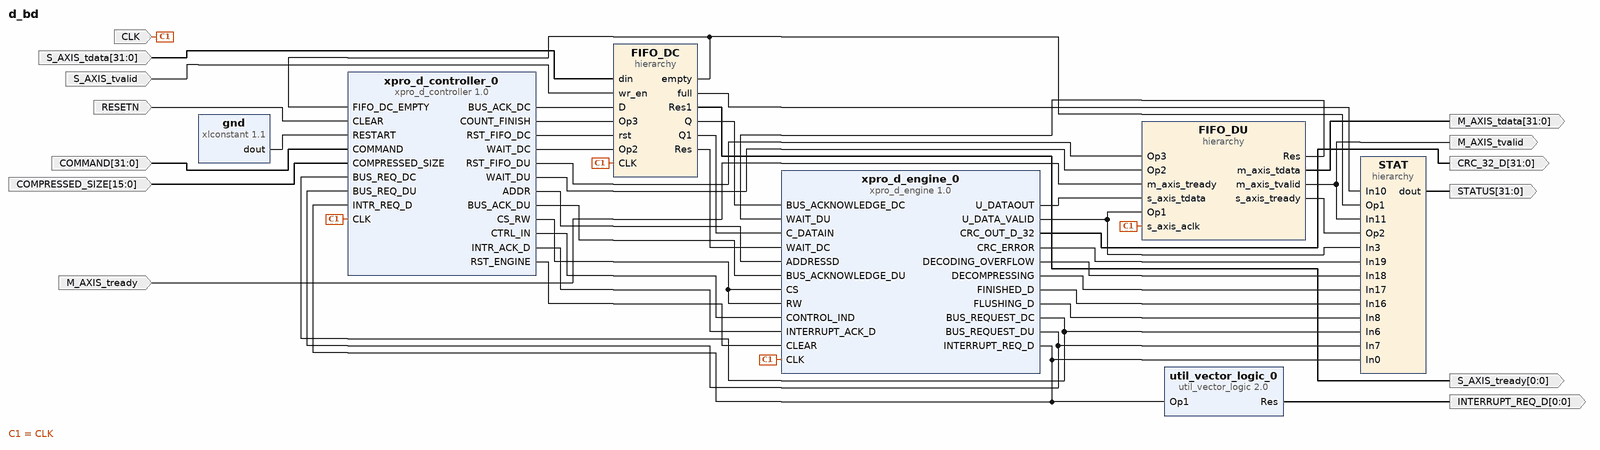
[diagram p0: block diagram of the top level]
# Vivado block design d_bd, Vivado 2014.4
create_bd_design d_bd

create_bd_port -dir I -type clk CLK
create_bd_port -dir I -from 31 -to 0 COMMAND
create_bd_port -dir I -from 15 -to 0 COMPRESSED_SIZE
create_bd_port -dir O -from 31 -to 0 CRC_32_D
create_bd_port -dir O -from 0 -to 0 INTERRUPT_REQ_D
create_bd_port -dir O -from 31 -to 0 M_AXIS_tdata
create_bd_port -dir I M_AXIS_tready
create_bd_port -dir O M_AXIS_tvalid
create_bd_port -dir I RESETN
create_bd_port -dir O -from 31 -to 0 STATUS
create_bd_port -dir I -from 31 -to 0 S_AXIS_tdata
create_bd_port -dir O -from 0 -to 0 S_AXIS_tready
create_bd_port -dir I S_AXIS_tvalid

create_bd_cell -type hier FIFO_DC
create_bd_cell -type hier FIFO_DU
create_bd_cell -type hier STAT
create_bd_cell -type ip -vlnv xilinx.com:ip:xlconstant:1.1 gnd
set_property -dict {CONFIG.CONST_VAL 0} [get_bd_cells gnd]
create_bd_cell -type ip -vlnv xilinx.com:ip:util_vector_logic:2.0 util_vector_logic_0
set_property -dict {CONFIG.C_SIZE 1 CONFIG.C_OPERATION not} [get_bd_cells util_vector_logic_0]
create_bd_cell -type ip -vlnv mohdazainol:user_ip:xpro_d_controller:1.0 xpro_d_controller_0
create_bd_cell -type ip -vlnv mohdazainol:user_ip:xpro_d_engine:1.0 xpro_d_engine_0

# ---- hierarchy /FIFO_DC ----
current_bd_instance /FIFO_DC
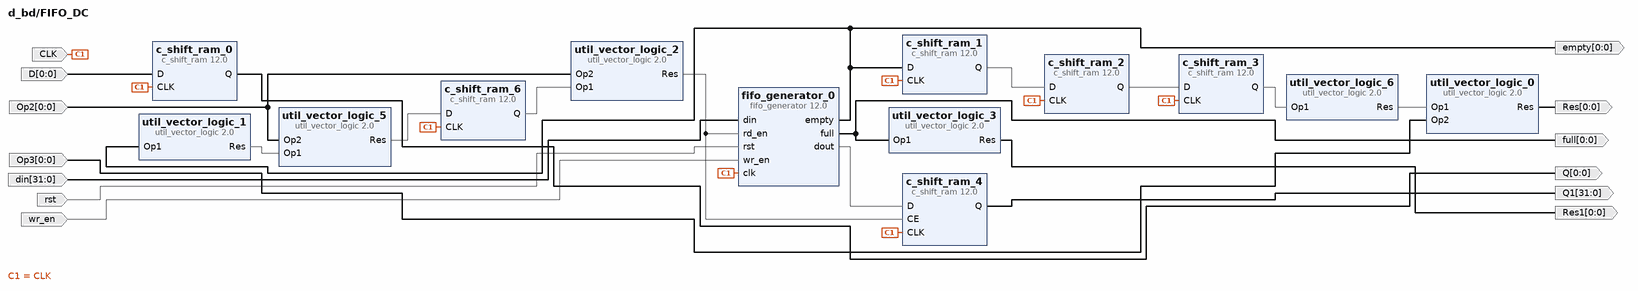
[diagram p1: block diagram inside /FIFO_DC]
create_bd_pin -dir I -type clk CLK
create_bd_pin -dir I -from 0 -to 0 -type data D
create_bd_pin -dir I -from 0 -to 0 Op2
create_bd_pin -dir I -from 0 -to 0 Op3
create_bd_pin -dir O -from 0 -to 0 -type data Q
create_bd_pin -dir O -from 31 -to 0 -type data Q1
create_bd_pin -dir O -from 0 -to 0 Res
create_bd_pin -dir O -from 0 -to 0 Res1
create_bd_pin -dir I -from 31 -to 0 din
create_bd_pin -dir O -from 0 -to 0 empty
create_bd_pin -dir O -from 0 -to 0 full
create_bd_pin -dir I rst
create_bd_pin -dir I wr_en

create_bd_cell -type ip -vlnv xilinx.com:ip:c_shift_ram:12.0 c_shift_ram_0
set_property -dict {CONFIG.Width 1 CONFIG.Depth 1 CONFIG.DefaultData 0 CONFIG.AsyncInitVal 0} [get_bd_cells c_shift_ram_0]
create_bd_cell -type ip -vlnv xilinx.com:ip:c_shift_ram:12.0 c_shift_ram_1
set_property -dict {CONFIG.Width 1 CONFIG.Depth 1 CONFIG.DefaultData 0 CONFIG.AsyncInitVal 0} [get_bd_cells c_shift_ram_1]
create_bd_cell -type ip -vlnv xilinx.com:ip:c_shift_ram:12.0 c_shift_ram_2
set_property -dict {CONFIG.Width 1 CONFIG.Depth 1 CONFIG.DefaultData 0 CONFIG.AsyncInitVal 0} [get_bd_cells c_shift_ram_2]
create_bd_cell -type ip -vlnv xilinx.com:ip:c_shift_ram:12.0 c_shift_ram_3
set_property -dict {CONFIG.Width 1 CONFIG.Depth 1 CONFIG.DefaultData 0 CONFIG.AsyncInitVal 0} [get_bd_cells c_shift_ram_3]
create_bd_cell -type ip -vlnv xilinx.com:ip:c_shift_ram:12.0 c_shift_ram_4
set_property -dict [list \
  CONFIG.CE true \
  CONFIG.Width 32 \
  CONFIG.Depth 1 \
  CONFIG.DefaultData 00000000000000000000000000000000 \
  CONFIG.AsyncInitVal 00000000000000000000000000000000 \
] [get_bd_cells c_shift_ram_4]
create_bd_cell -type ip -vlnv xilinx.com:ip:c_shift_ram:12.0 c_shift_ram_6
set_property -dict {CONFIG.Width 1 CONFIG.Depth 1 CONFIG.DefaultData 0 CONFIG.AsyncInitVal 0} [get_bd_cells c_shift_ram_6]
create_bd_cell -type ip -vlnv xilinx.com:ip:fifo_generator:12.0 fifo_generator_0
set_property -dict {CONFIG.Input_Data_Width 32} [get_bd_cells fifo_generator_0]
create_bd_cell -type ip -vlnv xilinx.com:ip:util_vector_logic:2.0 util_vector_logic_0
set_property -dict {CONFIG.C_SIZE 1 CONFIG.C_OPERATION or} [get_bd_cells util_vector_logic_0]
create_bd_cell -type ip -vlnv xilinx.com:ip:util_vector_logic:2.0 util_vector_logic_1
set_property -dict {CONFIG.C_SIZE 1 CONFIG.C_OPERATION not} [get_bd_cells util_vector_logic_1]
create_bd_cell -type ip -vlnv xilinx.com:ip:util_vector_logic:2.0 util_vector_logic_2
set_property -dict {CONFIG.C_SIZE 1} [get_bd_cells util_vector_logic_2]
create_bd_cell -type ip -vlnv xilinx.com:ip:util_vector_logic:2.0 util_vector_logic_3
set_property -dict {CONFIG.C_SIZE 1 CONFIG.C_OPERATION not} [get_bd_cells util_vector_logic_3]
create_bd_cell -type ip -vlnv xilinx.com:ip:util_vector_logic:2.0 util_vector_logic_5
set_property -dict {CONFIG.C_SIZE 1} [get_bd_cells util_vector_logic_5]
create_bd_cell -type ip -vlnv xilinx.com:ip:util_vector_logic:2.0 util_vector_logic_6
set_property -dict {CONFIG.C_SIZE 1 CONFIG.C_OPERATION not} [get_bd_cells util_vector_logic_6]

# ---- hierarchy /FIFO_DU ----
current_bd_instance /FIFO_DU
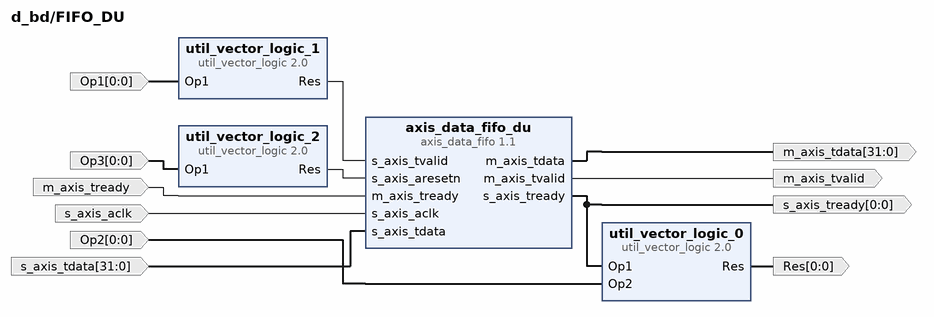
[diagram p2: block diagram inside /FIFO_DU]
create_bd_pin -dir I -from 0 -to 0 Op1
create_bd_pin -dir I -from 0 -to 0 Op2
create_bd_pin -dir I -from 0 -to 0 Op3
create_bd_pin -dir O -from 0 -to 0 Res
create_bd_pin -dir O -from 31 -to 0 m_axis_tdata
create_bd_pin -dir I m_axis_tready
create_bd_pin -dir O m_axis_tvalid
create_bd_pin -dir I -type clk s_axis_aclk
create_bd_pin -dir I -from 31 -to 0 s_axis_tdata
create_bd_pin -dir O -from 0 -to 0 s_axis_tready

create_bd_cell -type ip -vlnv xilinx.com:ip:axis_data_fifo:1.1 axis_data_fifo_du
set_property -dict {CONFIG.TDATA_NUM_BYTES 4} [get_bd_cells axis_data_fifo_du]
create_bd_cell -type ip -vlnv xilinx.com:ip:util_vector_logic:2.0 util_vector_logic_0
set_property -dict {CONFIG.C_SIZE 1} [get_bd_cells util_vector_logic_0]
create_bd_cell -type ip -vlnv xilinx.com:ip:util_vector_logic:2.0 util_vector_logic_1
set_property -dict {CONFIG.C_SIZE 1 CONFIG.C_OPERATION not} [get_bd_cells util_vector_logic_1]
create_bd_cell -type ip -vlnv xilinx.com:ip:util_vector_logic:2.0 util_vector_logic_2
set_property -dict {CONFIG.C_SIZE 1 CONFIG.C_OPERATION not} [get_bd_cells util_vector_logic_2]

# ---- hierarchy /STAT ----
current_bd_instance /STAT
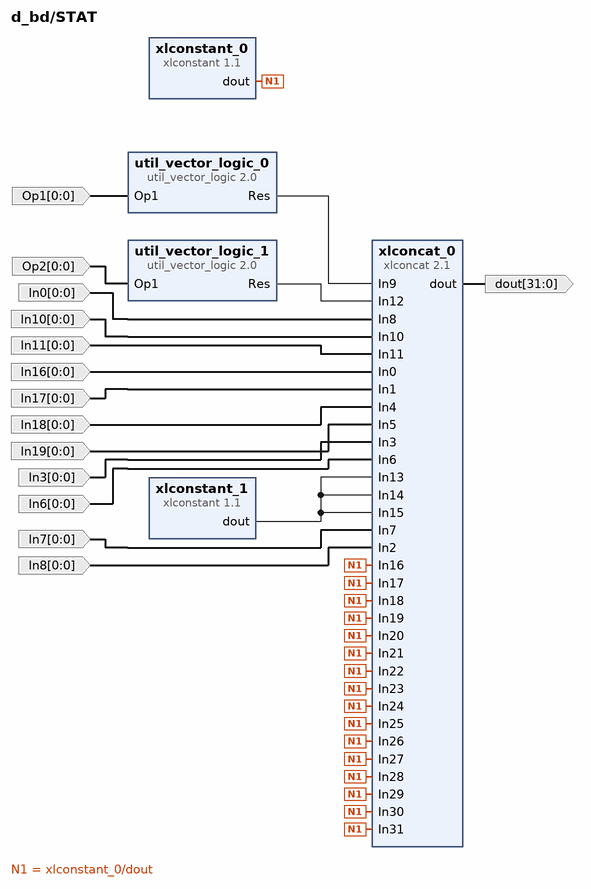
[diagram p3: block diagram inside /STAT]
create_bd_pin -dir I -from 0 -to 0 In0
create_bd_pin -dir I -from 0 -to 0 In3
create_bd_pin -dir I -from 0 -to 0 In6
create_bd_pin -dir I -from 0 -to 0 In7
create_bd_pin -dir I -from 0 -to 0 In8
create_bd_pin -dir I -from 0 -to 0 In10
create_bd_pin -dir I -from 0 -to 0 In11
create_bd_pin -dir I -from 0 -to 0 In16
create_bd_pin -dir I -from 0 -to 0 In17
create_bd_pin -dir I -from 0 -to 0 In18
create_bd_pin -dir I -from 0 -to 0 In19
create_bd_pin -dir I -from 0 -to 0 Op1
create_bd_pin -dir I -from 0 -to 0 Op2
create_bd_pin -dir O -from 31 -to 0 dout

create_bd_cell -type ip -vlnv xilinx.com:ip:util_vector_logic:2.0 util_vector_logic_0
set_property -dict {CONFIG.C_SIZE 1 CONFIG.C_OPERATION not} [get_bd_cells util_vector_logic_0]
create_bd_cell -type ip -vlnv xilinx.com:ip:util_vector_logic:2.0 util_vector_logic_1
set_property -dict {CONFIG.C_SIZE 1 CONFIG.C_OPERATION not} [get_bd_cells util_vector_logic_1]
create_bd_cell -type ip -vlnv xilinx.com:ip:xlconcat:2.1 xlconcat_0
set_property -dict {CONFIG.NUM_PORTS 32} [get_bd_cells xlconcat_0]
create_bd_cell -type ip -vlnv xilinx.com:ip:xlconstant:1.1 xlconstant_0
set_property -dict {CONFIG.CONST_VAL 0} [get_bd_cells xlconstant_0]
create_bd_cell -type ip -vlnv xilinx.com:ip:xlconstant:1.1 xlconstant_1
set_property -dict {CONFIG.CONST_VAL 0} [get_bd_cells xlconstant_1]

# ---- connections ----

current_bd_instance /FIFO_DC
connect_bd_net [get_bd_pins CLK] \
  [get_bd_pins c_shift_ram_0/CLK] [get_bd_pins c_shift_ram_1/CLK] [get_bd_pins c_shift_ram_2/CLK] \
  [get_bd_pins c_shift_ram_3/CLK] [get_bd_pins c_shift_ram_4/CLK] [get_bd_pins c_shift_ram_6/CLK] \
  [get_bd_pins fifo_generator_0/clk]
connect_bd_net [get_bd_pins D] [get_bd_pins c_shift_ram_0/D]
connect_bd_net -net Op2_1 [get_bd_pins Op2] [get_bd_pins util_vector_logic_2/Op2] [get_bd_pins util_vector_logic_5/Op2]
connect_bd_net -net Op3_1 [get_bd_pins Op3] [get_bd_pins util_vector_logic_0/Op2]
connect_bd_net [get_bd_pins c_shift_ram_0/Q] [get_bd_pins Q]
connect_bd_net [get_bd_pins c_shift_ram_1/Q] [get_bd_pins c_shift_ram_2/D]
connect_bd_net [get_bd_pins c_shift_ram_2/Q] [get_bd_pins c_shift_ram_3/D]
connect_bd_net [get_bd_pins c_shift_ram_3/Q] [get_bd_pins util_vector_logic_6/Op1]
connect_bd_net [get_bd_pins c_shift_ram_4/Q] [get_bd_pins Q1]
connect_bd_net [get_bd_pins c_shift_ram_6/Q] [get_bd_pins util_vector_logic_2/Op1]
connect_bd_net [get_bd_pins din] [get_bd_pins fifo_generator_0/din]
connect_bd_net [get_bd_pins fifo_generator_0/dout] [get_bd_pins c_shift_ram_4/D]
connect_bd_net [get_bd_pins fifo_generator_0/empty] [get_bd_pins empty] [get_bd_pins c_shift_ram_1/D] [get_bd_pins util_vector_logic_1/Op1]
connect_bd_net [get_bd_pins fifo_generator_0/full] [get_bd_pins full] [get_bd_pins util_vector_logic_3/Op1]
connect_bd_net [get_bd_pins rst] [get_bd_pins fifo_generator_0/rst]
connect_bd_net [get_bd_pins util_vector_logic_0/Res] [get_bd_pins Res]
connect_bd_net [get_bd_pins util_vector_logic_1/Res] [get_bd_pins util_vector_logic_5/Op1]
connect_bd_net [get_bd_pins util_vector_logic_2/Res] [get_bd_pins c_shift_ram_4/CE] [get_bd_pins fifo_generator_0/rd_en]
connect_bd_net [get_bd_pins util_vector_logic_3/Res] [get_bd_pins Res1]
connect_bd_net [get_bd_pins util_vector_logic_5/Res] [get_bd_pins c_shift_ram_6/D]
connect_bd_net [get_bd_pins util_vector_logic_6/Res] [get_bd_pins util_vector_logic_0/Op1]
connect_bd_net [get_bd_pins wr_en] [get_bd_pins fifo_generator_0/wr_en]

current_bd_instance /FIFO_DU
connect_bd_net -net Op1_1 [get_bd_pins Op1] [get_bd_pins util_vector_logic_1/Op1]
connect_bd_net -net Op2_1 [get_bd_pins Op2] [get_bd_pins util_vector_logic_0/Op2]
connect_bd_net -net Op3_1 [get_bd_pins Op3] [get_bd_pins util_vector_logic_2/Op1]
connect_bd_net -net axis_data_fifo_0_m_axis_tdata [get_bd_pins axis_data_fifo_du/m_axis_tdata] [get_bd_pins m_axis_tdata]
connect_bd_net -net axis_data_fifo_0_m_axis_tvalid [get_bd_pins axis_data_fifo_du/m_axis_tvalid] [get_bd_pins m_axis_tvalid]
connect_bd_net -net axis_data_fifo_0_s_axis_tready [get_bd_pins axis_data_fifo_du/s_axis_tready] \
  [get_bd_pins s_axis_tready] [get_bd_pins util_vector_logic_0/Op1]
connect_bd_net [get_bd_pins m_axis_tready] [get_bd_pins axis_data_fifo_du/m_axis_tready]
connect_bd_net [get_bd_pins s_axis_aclk] [get_bd_pins axis_data_fifo_du/s_axis_aclk]
connect_bd_net [get_bd_pins s_axis_tdata] [get_bd_pins axis_data_fifo_du/s_axis_tdata]
connect_bd_net [get_bd_pins util_vector_logic_0/Res] [get_bd_pins Res]
connect_bd_net [get_bd_pins util_vector_logic_1/Res] [get_bd_pins axis_data_fifo_du/s_axis_tvalid]
connect_bd_net [get_bd_pins util_vector_logic_2/Res] [get_bd_pins axis_data_fifo_du/s_axis_aresetn]

current_bd_instance /STAT
connect_bd_net -net In0_1 [get_bd_pins In0] [get_bd_pins xlconcat_0/In8]
connect_bd_net -net In10_1 [get_bd_pins In10] [get_bd_pins xlconcat_0/In10]
connect_bd_net -net In11_1 [get_bd_pins In11] [get_bd_pins xlconcat_0/In11]
connect_bd_net -net In16_1 [get_bd_pins In16] [get_bd_pins xlconcat_0/In0]
connect_bd_net -net In17_1 [get_bd_pins In17] [get_bd_pins xlconcat_0/In1]
connect_bd_net -net In18_1 [get_bd_pins In18] [get_bd_pins xlconcat_0/In4]
connect_bd_net -net In19_1 [get_bd_pins In19] [get_bd_pins xlconcat_0/In5]
connect_bd_net -net In3_1 [get_bd_pins In3] [get_bd_pins xlconcat_0/In3]
connect_bd_net -net In6_1 [get_bd_pins In6] [get_bd_pins xlconcat_0/In6]
connect_bd_net -net In7_1 [get_bd_pins In7] [get_bd_pins xlconcat_0/In7]
connect_bd_net -net In8_1 [get_bd_pins In8] [get_bd_pins xlconcat_0/In2]
connect_bd_net -net Op1_1 [get_bd_pins Op1] [get_bd_pins util_vector_logic_0/Op1]
connect_bd_net -net Op2_1 [get_bd_pins Op2] [get_bd_pins util_vector_logic_1/Op1]
connect_bd_net [get_bd_pins util_vector_logic_0/Res] [get_bd_pins xlconcat_0/In9]
connect_bd_net [get_bd_pins util_vector_logic_1/Res] [get_bd_pins xlconcat_0/In12]
connect_bd_net [get_bd_pins xlconcat_0/dout] [get_bd_pins dout]
connect_bd_net [get_bd_pins xlconstant_0/dout] \
  [get_bd_pins xlconcat_0/In16] [get_bd_pins xlconcat_0/In17] [get_bd_pins xlconcat_0/In18] [get_bd_pins xlconcat_0/In19] \
  [get_bd_pins xlconcat_0/In20] [get_bd_pins xlconcat_0/In21] [get_bd_pins xlconcat_0/In22] [get_bd_pins xlconcat_0/In23] \
  [get_bd_pins xlconcat_0/In24] [get_bd_pins xlconcat_0/In25] [get_bd_pins xlconcat_0/In26] [get_bd_pins xlconcat_0/In27] \
  [get_bd_pins xlconcat_0/In28] [get_bd_pins xlconcat_0/In29] [get_bd_pins xlconcat_0/In30] [get_bd_pins xlconcat_0/In31]
connect_bd_net [get_bd_pins xlconstant_1/dout] [get_bd_pins xlconcat_0/In13] [get_bd_pins xlconcat_0/In14] [get_bd_pins xlconcat_0/In15]

current_bd_instance /
connect_bd_net -net CLEAR_1 [get_bd_ports RESETN] [get_bd_pins xpro_d_controller_0/CLEAR]
connect_bd_net [get_bd_ports CLK] \
  [get_bd_pins FIFO_DC/CLK] [get_bd_pins FIFO_DU/s_axis_aclk] [get_bd_pins xpro_d_controller_0/CLK] \
  [get_bd_pins xpro_d_engine_0/CLK]
connect_bd_net [get_bd_ports COMMAND] [get_bd_pins xpro_d_controller_0/COMMAND]
connect_bd_net [get_bd_ports COMPRESSED_SIZE] [get_bd_pins xpro_d_controller_0/COMPRESSED_SIZE]
connect_bd_net [get_bd_pins FIFO_DC/Q] [get_bd_pins xpro_d_engine_0/BUS_ACKNOWLEDGE_DC]
connect_bd_net [get_bd_pins FIFO_DC/Q1] [get_bd_pins xpro_d_engine_0/C_DATAIN]
connect_bd_net [get_bd_pins FIFO_DC/Res] [get_bd_pins xpro_d_engine_0/WAIT_DC]
connect_bd_net [get_bd_pins FIFO_DC/Res1] [get_bd_ports S_AXIS_tready]
connect_bd_net [get_bd_pins FIFO_DU/Res] [get_bd_pins xpro_d_engine_0/WAIT_DU]
connect_bd_net [get_bd_pins FIFO_DU/m_axis_tdata] [get_bd_ports M_AXIS_tdata]
connect_bd_net [get_bd_pins FIFO_DU/m_axis_tvalid] [get_bd_ports M_AXIS_tvalid] [get_bd_pins STAT/In11]
connect_bd_net -net In10_1 [get_bd_pins FIFO_DC/full] [get_bd_pins STAT/In10]
connect_bd_net -net Op1_1 [get_bd_pins FIFO_DC/empty] [get_bd_pins STAT/Op1] [get_bd_pins xpro_d_controller_0/FIFO_DC_EMPTY]
connect_bd_net -net Op2_1 [get_bd_pins FIFO_DU/s_axis_tready] [get_bd_pins STAT/Op2]
connect_bd_net [get_bd_pins STAT/dout] [get_bd_ports STATUS]
connect_bd_net -net din_1 [get_bd_ports S_AXIS_tdata] [get_bd_pins FIFO_DC/din]
connect_bd_net [get_bd_pins gnd/dout] [get_bd_pins xpro_d_controller_0/RESTART]
connect_bd_net [get_bd_ports M_AXIS_tready] [get_bd_pins FIFO_DU/m_axis_tready]
connect_bd_net [get_bd_pins util_vector_logic_0/Res] [get_bd_ports INTERRUPT_REQ_D]
connect_bd_net -net wr_en_1 [get_bd_ports S_AXIS_tvalid] [get_bd_pins FIFO_DC/wr_en]
connect_bd_net [get_bd_pins xpro_d_controller_0/ADDR] [get_bd_pins xpro_d_engine_0/ADDRESSD]
connect_bd_net [get_bd_pins xpro_d_controller_0/BUS_ACK_DC] [get_bd_pins FIFO_DC/D]
connect_bd_net [get_bd_pins xpro_d_controller_0/BUS_ACK_DU] [get_bd_pins xpro_d_engine_0/BUS_ACKNOWLEDGE_DU]
connect_bd_net [get_bd_pins xpro_d_controller_0/COUNT_FINISH] [get_bd_pins FIFO_DC/Op3]
connect_bd_net [get_bd_pins xpro_d_controller_0/CS_RW] [get_bd_pins xpro_d_engine_0/CS] [get_bd_pins xpro_d_engine_0/RW]
connect_bd_net [get_bd_pins xpro_d_controller_0/CTRL_IN] [get_bd_pins xpro_d_engine_0/CONTROL_IND]
connect_bd_net [get_bd_pins xpro_d_controller_0/INTR_ACK_D] [get_bd_pins xpro_d_engine_0/INTERRUPT_ACK_D]
connect_bd_net [get_bd_pins xpro_d_controller_0/RST_ENGINE] [get_bd_pins xpro_d_engine_0/CLEAR]
connect_bd_net [get_bd_pins xpro_d_controller_0/RST_FIFO_DC] [get_bd_pins FIFO_DC/rst]
connect_bd_net [get_bd_pins xpro_d_controller_0/RST_FIFO_DU] [get_bd_pins FIFO_DU/Op3]
connect_bd_net [get_bd_pins xpro_d_controller_0/WAIT_DC] [get_bd_pins FIFO_DC/Op2]
connect_bd_net [get_bd_pins xpro_d_controller_0/WAIT_DU] [get_bd_pins FIFO_DU/Op2]
connect_bd_net [get_bd_pins xpro_d_engine_0/BUS_REQUEST_DC] [get_bd_pins STAT/In6] [get_bd_pins xpro_d_controller_0/BUS_REQ_DC]
connect_bd_net [get_bd_pins xpro_d_engine_0/BUS_REQUEST_DU] [get_bd_pins STAT/In7] [get_bd_pins xpro_d_controller_0/BUS_REQ_DU]
connect_bd_net [get_bd_pins xpro_d_engine_0/CRC_ERROR] [get_bd_pins STAT/In19]
connect_bd_net [get_bd_pins xpro_d_engine_0/CRC_OUT_D_32] [get_bd_ports CRC_32_D]
connect_bd_net [get_bd_pins xpro_d_engine_0/DECODING_OVERFLOW] [get_bd_pins STAT/In18]
connect_bd_net [get_bd_pins xpro_d_engine_0/DECOMPRESSING] [get_bd_pins STAT/In17]
connect_bd_net [get_bd_pins xpro_d_engine_0/FINISHED_D] [get_bd_pins STAT/In16]
connect_bd_net [get_bd_pins xpro_d_engine_0/FLUSHING_D] [get_bd_pins STAT/In8]
connect_bd_net [get_bd_pins xpro_d_engine_0/INTERRUPT_REQ_D] \
  [get_bd_pins STAT/In0] [get_bd_pins util_vector_logic_0/Op1] [get_bd_pins xpro_d_controller_0/INTR_REQ_D]
connect_bd_net [get_bd_pins xpro_d_engine_0/U_DATAOUT] [get_bd_pins FIFO_DU/s_axis_tdata]
connect_bd_net [get_bd_pins xpro_d_engine_0/U_DATA_VALID] [get_bd_pins FIFO_DU/Op1] [get_bd_pins STAT/In3]

validate_bd_design
save_bd_design
